# EAGLE design shield-imu (EAGLE 7.6.0)
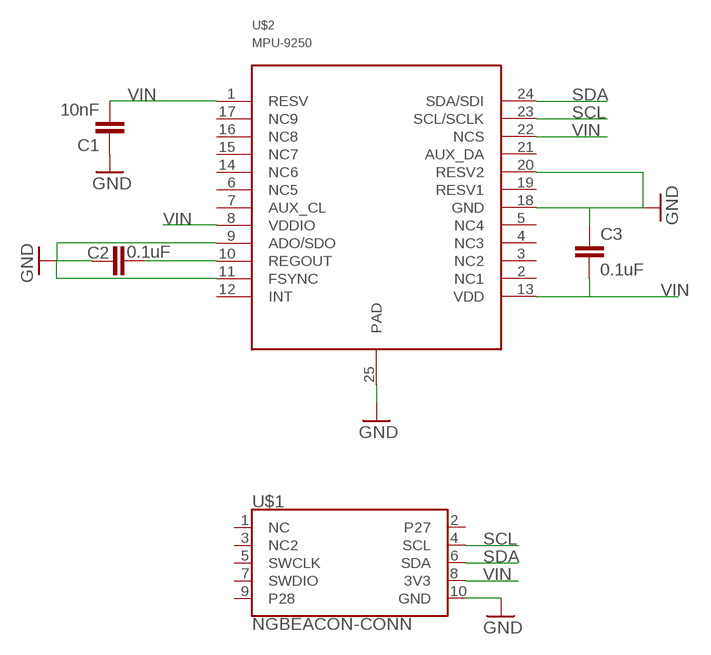
[diagram p0: schematic, sheet 1]

## Parts
C1  10nF  10NF/10000PF-50V-10%(0603)  [0603-CAP]
C2  0.1uF  0.1UF-25V-5%(0603)  [0603-CAP]
C3  0.1uF  0.1UF-25V-5%(0603)  [0603-CAP]
U$1  NGBEACON-CONN  [2X5-PTH-1.27MM]
U$2  MPU-9250  [LEAD-QFN24]

## Nets
GND: C1.1 C2.1 C3.1 U$1.10(GND) U$2.9(ADO/SDO) U$2.11(FSYNC) U$2.18(GND) U$2.20(RESV2) U$2.25(PAD)
N$5: C2.2 U$2.10(REGOUT)
SCL: U$1.4(SCL) U$2.23(SCL/SCLK)
SDA: U$1.6(SDA) U$2.24(SDA/SDI)
VIN: C1.2 C3.2 U$1.8(3V3) U$2.1(RESV) U$2.8(VDDIO) U$2.13(VDD) U$2.22(NCS)
Unconnected: U$1.1(NC) U$1.2(P27) U$1.3(NC2) U$1.5(SWCLK) U$1.7(SWDIO) U$1.9(P28) U$2.2(NC1) U$2.3(NC2) U$2.4(NC3) U$2.5(NC4) U$2.6(NC5) U$2.7(AUX_CL) U$2.12(INT) U$2.14(NC6) U$2.15(NC7) U$2.16(NC8) U$2.17(NC9) U$2.19(RESV1) U$2.21(AUX_DA)

## Library data of the parts
C1 = SparkFun-Capacitors:10NF/10000PF-50V-10%(0603): CAP-00867; PROD_ID: CAP-00867
C2 C3 = SparkFun-Capacitors:0.1UF-25V-5%(0603): CAP-08604; PROD_ID: CAP-08604
U$1 = ng-beacon:NGBEACON-CONN
U$2 = invensense:MPU-9250

## Board
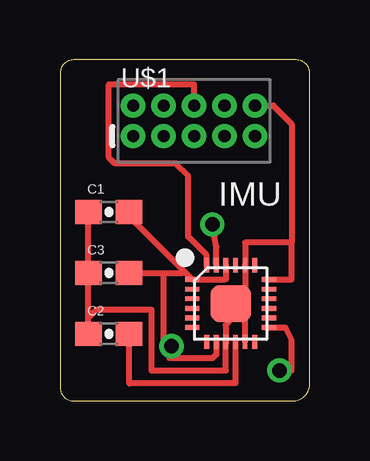
[diagram p1: board, top side]
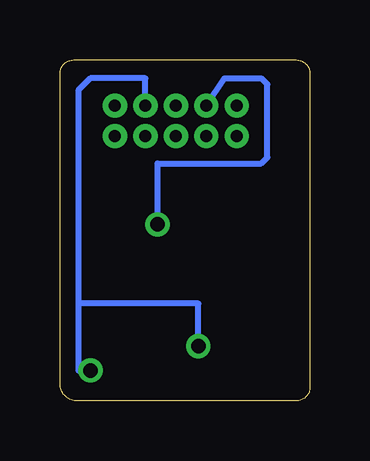
[diagram p2: board, bottom side, seen from below]

Size 10.41 x 14.22 mm. Coordinates in mm from the lower left corner, seen from the top.
Outline: 0,13.66 0,0.57 arc90 0.57,0 9.7,0 arc90 10.41,0.72 10.41,13.66 arc90 9.85,14.22 0.57,14.22 arc90 0,13.66
Copper layers (1*16): Top 0.035mm / dielectric 1.5mm / Bottom 0.035mm
Design rules "default": minimum track width 10mil, minimum drill 24mil, track to track 8mil, track to pad 8mil, pad to pad 8mil, via to via 8mil, smd to smd 8mil, copper to edge 40mil, drill to drill 8mil, minimum pad ring 10mil, minimum via ring 8mil, stop-mask expansion 4mil, vias tented up to drill 0mil, thermal gap 10mil

### Footprints (pad centres in the part's own frame; a part is rotated, then mirrored left to right if it is on the bottom)
0603-CAP = smd 1.1 x 1: 1 -0.85,0; 2 0.85,0
2X5-PTH-1.27MM = drill 0.508 pad 1: 1 -2.54,-0.635; 2 -2.54,0.635; 3 -1.27,-0.635; 4 -1.27,0.635; 5 0,-0.635; 6 0,0.635; 7 1.27,-0.635; 8 1.27,0.635; 9 2.54,-0.635; 10 2.54,0.635
LEAD-QFN24 = smd 0.6 x 0.2: 1 -1.6,1; 2 -1.6,0.6; 3 -1.6,0.2; 4 -1.6,-0.2; 5 -1.6,-0.6; 6 -1.6,-1; 13 1.6,-1; 14 1.6,-0.6; 15 1.6,-0.2; 16 1.6,0.2; 17 1.6,0.6; 18 1.6,1 | smd 0.2 x 0.6: 7 -1,-1.6; 8 -0.6,-1.6; 9 -0.2,-1.6; 10 0.2,-1.6; 11 0.6,-1.6; 12 1,-1.6; 19 1,1.6; 20 0.6,1.6; 21 0.2,1.6; 22 -0.2,1.6; 23 -0.6,1.6; 24 -1,1.6 | smd 1.7 x 1.54: 25 0,0

### Placement (x,y rotation side)
C1  2.03,7.87 0 top
C2  2.03,2.79 0 top
C3  2.03,5.33 0 top
U$1  5.59,11.68 0 top
U$2  7.11,4.06 0 top

### Tracks (layer width: path | path; a pad name or v marks a point on that pad's centre or on a via)
GND
  Top 0.254: 9.65,6.6 9.65,11.56 8.89,12.32 U$1.10 | U$2.18 9.65,5.06 9.65,6.6 | 9.65,6.6 7.71,6.6 U$2.20 7.71,4.66 U$2.25 | U$2.25 7.11,3.37 6.9,3.16 U$2.9 6.91,2.41 6.91,1.27 3.81,1.27 3.81,3.81 1.52,3.81 1.18,3.47 C2.1 | C2.1 C1.1 | C2.1 C3.1 | U$2.11 7.71,3.46 U$2.25
N$5
  Top 0.254: U$2.10 7.31,0.74 5.54,0.74 2.89,0.73 C2.2
SCL  (via drill 0.6)
  Top 0.254: U$2.23 6.51,6.44 v6.35,7.37
  Bottom 0.254: v6.35,7.37 6.35,9.91 2.03,9.91 1.78,10.16 1.78,13.21 2.03,13.46 3.56,13.46 U$1.4
SDA
  Top 0.254: U$2.24 6.11,6.08 5.33,6.86 5.33,9.4 4.83,9.91 2.29,9.91 2.03,10.16 2.03,13.21 5.59,13.21 U$1.6
VIN  (via drill 0.6)
  Top 0.254: C1.2 2.88,7.69 5.16,5.41 | 5.16,5.41 U$2.1 6.84,5.06 6.91,5.08 6.91,5.61 U$2.22 | v9.14,1.27 9.65,1.27 9.65,2.54 9.4,3.05 8.73,3.05 U$2.13 | C3.2 4.32,5.33 | 4.32,5.33 5.08,5.33 5.16,5.41 | 4.32,5.33 4.32,2.54 v4.65,2.29 4.57,1.78 6.35,1.78 6.51,1.94 U$2.8
  Bottom 0.254: v4.65,2.29 4.65,4.06 9.65,4.06 | U$1.8 6.86,13.46 9.14,13.46 9.65,12.95 9.65,4.06 | 9.65,4.06 9.65,1.27 v9.14,1.27

### Text on the board
tNames: IMU